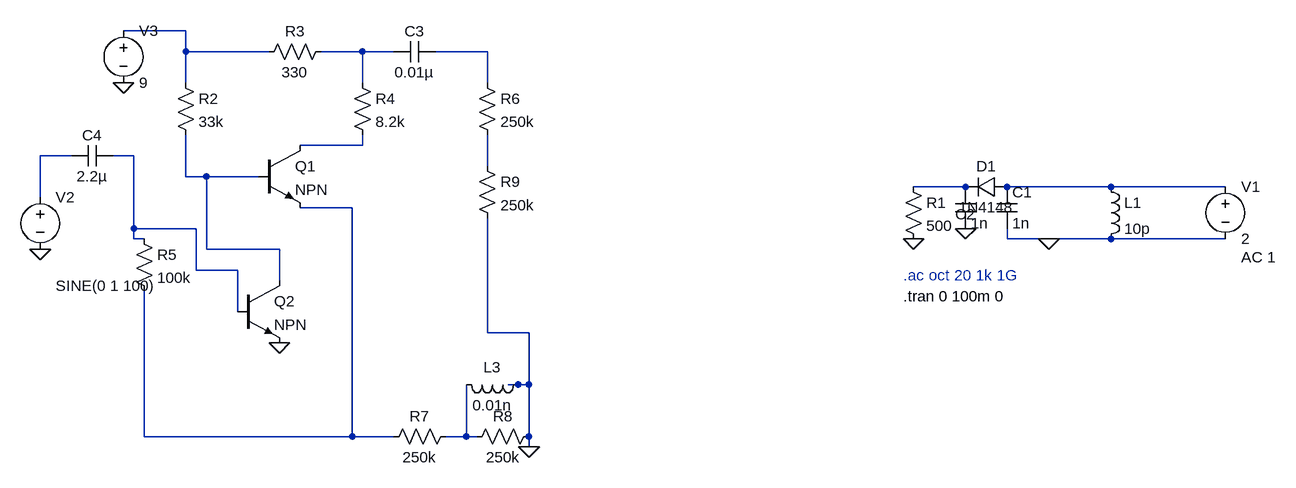
[diagram p0: schematic breath_coil.asc]
breath_coil.asc, the LTspice schematic file:
Version 4
SHEET 1 880 680
WIRE -1120 -144 -1216 -144
WIRE -1120 -112 -1120 -144
WIRE -992 -112 -1120 -112
WIRE -848 -112 -912 -112
WIRE -800 -112 -848 -112
WIRE -656 -112 -736 -112
WIRE -1120 -64 -1120 -112
WIRE -848 -64 -848 -112
WIRE -656 -64 -656 -112
WIRE -848 32 -848 16
WIRE -848 32 -944 32
WIRE -1296 48 -1344 48
WIRE -1200 48 -1232 48
WIRE -656 64 -656 16
WIRE -1120 80 -1120 16
WIRE -1088 80 -1120 80
WIRE -1008 80 -1088 80
WIRE 80 96 0 96
WIRE 304 96 144 96
WIRE 480 96 304 96
WIRE -1344 112 -1344 48
WIRE -864 128 -944 128
WIRE -1200 160 -1200 48
WIRE -1104 160 -1200 160
WIRE -1200 176 -1200 160
WIRE -1184 176 -1200 176
WIRE 144 176 144 160
WIRE 208 176 144 176
WIRE 304 176 208 176
WIRE 480 176 304 176
WIRE -1088 192 -1088 80
WIRE -976 192 -1088 192
WIRE -1104 224 -1104 160
WIRE -1040 224 -1104 224
WIRE -976 240 -976 192
WIRE -1040 288 -1040 224
WIRE -656 320 -656 144
WIRE -592 320 -656 320
WIRE -608 400 -624 400
WIRE -592 400 -592 320
WIRE -592 400 -608 400
WIRE -1184 480 -1184 256
WIRE -864 480 -864 128
WIRE -864 480 -1184 480
WIRE -800 480 -864 480
WIRE -688 480 -688 400
WIRE -688 480 -720 480
WIRE -672 480 -688 480
WIRE -592 480 -592 400
WIRE -592 496 -592 480
FLAG 208 176 0
FLAG 80 160 0
FLAG 0 176 0
FLAG -976 336 0
FLAG -592 496 0
FLAG -1344 192 0
FLAG -1216 -64 0
SYMBOL cap 128 96 R0
SYMATTR InstName C1
SYMATTR Value 1n
SYMBOL diode 144 80 R90
WINDOW 0 0 32 VBottom 2
WINDOW 3 32 32 VTop 2
SYMATTR InstName D1
SYMATTR Value 1N4148
SYMBOL cap 64 96 R0
WINDOW 0 0 42 Left 2
SYMATTR InstName C2
SYMATTR Value 1n
SYMBOL res -16 80 R0
SYMATTR InstName R1
SYMATTR Value 500
SYMBOL ind 288 80 R0
SYMATTR InstName L1
SYMATTR Value 10p
SYMBOL voltage 480 80 R0
WINDOW 123 24 124 Left 2
WINDOW 39 0 0 Left 0
SYMATTR Value2 AC 1
SYMATTR InstName V1
SYMATTR Value 2
SYMBOL res -1136 -80 R0
SYMATTR InstName R2
SYMATTR Value 33k
SYMBOL res -896 -128 R90
WINDOW 0 0 56 VBottom 2
WINDOW 3 32 56 VTop 2
SYMATTR InstName R3
SYMATTR Value 330
SYMBOL res -864 -80 R0
SYMATTR InstName R4
SYMATTR Value 8.2k
SYMBOL cap -1232 32 R90
WINDOW 0 0 32 VBottom 2
WINDOW 3 32 32 VTop 2
SYMATTR InstName C4
SYMATTR Value 2.2µ
SYMBOL res -1200 160 R0
SYMATTR InstName R5
SYMATTR Value 100k
SYMBOL npn -1008 32 R0
SYMATTR InstName Q1
SYMBOL npn -1040 240 R0
SYMATTR InstName Q2
SYMBOL res -672 -80 R0
SYMATTR InstName R6
SYMATTR Value 250k
SYMBOL res -704 464 R90
WINDOW 0 0 56 VBottom 2
WINDOW 3 32 56 VTop 2
SYMATTR InstName R7
SYMATTR Value 250k
SYMBOL res -576 464 R90
WINDOW 0 0 56 VBottom 2
WINDOW 3 32 56 VTop 2
SYMATTR InstName R8
SYMATTR Value 250k
SYMBOL res -672 48 R0
SYMATTR InstName R9
SYMATTR Value 250k
SYMBOL voltage -1344 96 R0
WINDOW 3 24 152 Left 2
WINDOW 123 24 124 Left 2
WINDOW 39 0 0 Left 0
SYMATTR InstName V2
SYMATTR Value SINE(0 1 100)
SYMBOL voltage -1216 -160 R0
WINDOW 123 0 0 Left 0
WINDOW 39 0 0 Left 0
SYMATTR InstName V3
SYMATTR Value 9
SYMBOL ind -592 384 R90
WINDOW 0 5 56 VBottom 2
WINDOW 3 32 56 VTop 2
SYMATTR InstName L3
SYMATTR Value 0.01n
SYMBOL cap -736 -128 R90
WINDOW 0 0 32 VBottom 2
WINDOW 3 32 32 VTop 2
SYMATTR InstName C3
SYMATTR Value 0.01µ
TEXT -16 232 Left 2 ;.ac oct 20 1k 1G
TEXT -16 264 Left 2 !.tran 0 100m 0

The netlist it stands for:
* breath_coil.asc
C1 N010 0 1n
D1 N010 N009 1N4148
C2 N009 0 1n
R1 N009 0 500
L1 N010 0 10p
V1 N010 0 2 AC 1
R2 N001 N008 33k
R3 N002 N001 330
R4 N002 N004 8.2k
C4 N006 N005 2.2µ
R5 N006 N011 100k
Q1 N004 N008 N011 0 NPN
Q2 N008 N006 0 0 NPN
R6 N003 N007 250k
R7 N012 N011 250k
R8 0 N012 250k
R9 N007 0 250k
V2 N005 0 SINE(0 1 100)
V3 N001 0 9
L3 0 N012 0.01n
C3 N003 N002 0.01µ
.model D D
.lib standard.dio
.model NPN NPN
.model PNP PNP
.lib standard.bjt
* .ac oct 20 1k 1G
.tran 0 100m 0
.backanno
.end